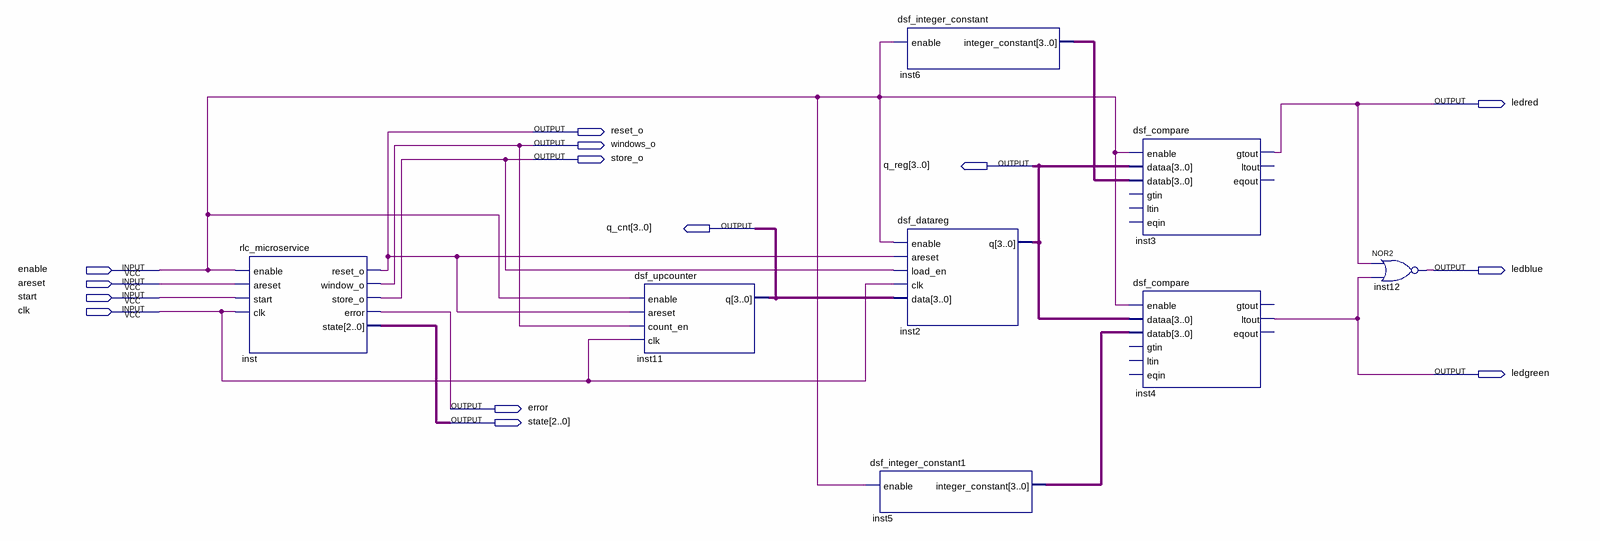
[diagram p0: schematic sheet]
// Quartus schematic radar.bdf as structural Verilog: 8 symbols, 14 pins
module radar (
  input  enable,
  input  areset,
  input  start,
  input  clk,
  output ledred,
  output reset_o,
  output windows_o,
  output store_o,
  output [3:0] q_reg,
  output [3:0] q_cnt,
  output ledblue,
  output ledgreen,
  output error,
  output [2:0] state
);

  wire [3:0] inst5_integer_constant, inst6_integer_constant;

  rlc_microservice inst (
    .enable(enable), .areset(areset), .start(start), .clk(clk), .reset_o(reset_o), .window_o(windows_o),
    .store_o(store_o), .error(error), .state(state));
  dsf_upcounter inst11 (.enable(enable), .areset(reset_o), .count_en(windows_o), .clk(clk), .q(q_cnt));
  dsf_integer_constant1 inst5 (.enable(enable), .integer_constant(inst5_integer_constant));
  dsf_integer_constant inst6 (.enable(enable), .integer_constant(inst6_integer_constant));
  dsf_datareg inst2 (.enable(enable), .areset(reset_o), .load_en(store_o), .clk(clk), .data(q_cnt), .q(q_reg));
  dsf_compare inst3 (
    .enable(enable), .dataa(q_reg), .datab(inst6_integer_constant), .gtout(ledred));  // open: gtin, ltin, eqin, ltout, eqout
  dsf_compare inst4 (
    .enable(enable), .dataa(q_reg), .datab(inst5_integer_constant), .ltout(ledgreen));  // open: gtin, ltin, eqin, gtout, eqout
  nor inst12 (ledblue, ledred, ledgreen);
endmodule
